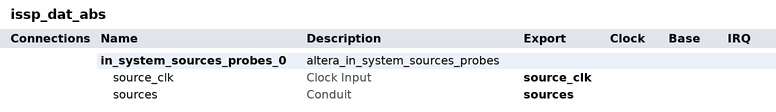
[diagram p0: system contents]
# Platform Designer (Qsys) system issp_dat_abs, Cyclone V 5CEBA4F17I7
# Parameters at their usual value, and those the tool derives, are not listed.
package require -exact qsys 16.1
create_system issp_dat_abs
set_project_property DEVICE_FAMILY {Cyclone V}
set_project_property DEVICE 5CEBA4F17I7

add_instance in_system_sources_probes_0 altera_in_system_sources_probes 16.1
set_instance_property in_system_sources_probes_0 AUTO_EXPORT true
set_instance_parameter_value in_system_sources_probes_0 create_source_clock true
set_instance_parameter_value in_system_sources_probes_0 create_source_clock_enable true
set_instance_parameter_value in_system_sources_probes_0 instance_id abs
set_instance_parameter_value in_system_sources_probes_0 probe_width 0
set_instance_parameter_value in_system_sources_probes_0 source_initial_value 4
set_instance_parameter_value in_system_sources_probes_0 source_width 16

# exported interfaces
add_interface source_clk clock sink
set_interface_property source_clk EXPORT_OF in_system_sources_probes_0.source_clk
add_interface sources conduit end
set_interface_property sources EXPORT_OF in_system_sources_probes_0.sources

set_interconnect_requirement {$system} qsys_mm.clockCrossingAdapter HANDSHAKE
set_interconnect_requirement {$system} qsys_mm.enableEccProtection FALSE
set_interconnect_requirement {$system} qsys_mm.insertDefaultSlave FALSE
set_interconnect_requirement {$system} qsys_mm.maxAdditionalLatency 1

save_system issp_dat_abs.qsys
